# EAGLE schematic OhEyeTester (EAGLE 6.2)
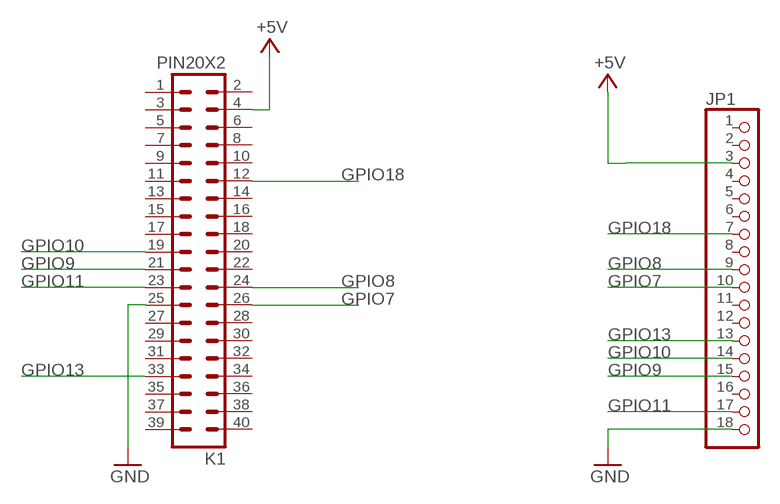
[diagram p0: schematic, sheet 1]

## Parts
JP1  PINHD-1X18  [1X18]
K1  PIN20X2  [PIN_20X2]

## Nets
+5V: JP1.3 K1.4
GND: JP1.18 K1.25
GPIO7: JP1.10 K1.26
GPIO8: JP1.9 K1.24
GPIO9: JP1.15 K1.21
GPIO10: JP1.14 K1.19
GPIO11: JP1.17 K1.23
GPIO13: JP1.13 K1.33
GPIO18: JP1.7 K1.12
Unconnected: JP1.1 JP1.2 JP1.4 JP1.5 JP1.6 JP1.8 JP1.11 JP1.12 JP1.16 K1.1 K1.2 K1.3 K1.5 K1.6 K1.7 K1.8 K1.9 K1.10 K1.11 K1.13 K1.14 K1.15 K1.16 K1.17 K1.18 K1.20 K1.22 K1.27 K1.28 K1.29 K1.30 K1.31 K1.32 K1.34 K1.35 K1.36 K1.37 K1.38 K1.39 K1.40

## Library data of the parts
JP1 = pinhead:PINHD-1X18: PIN HEADER
K1 = FLYFISH:PIN20X2